# Altium schematic sheet 测试板3.SchDoc
size A3
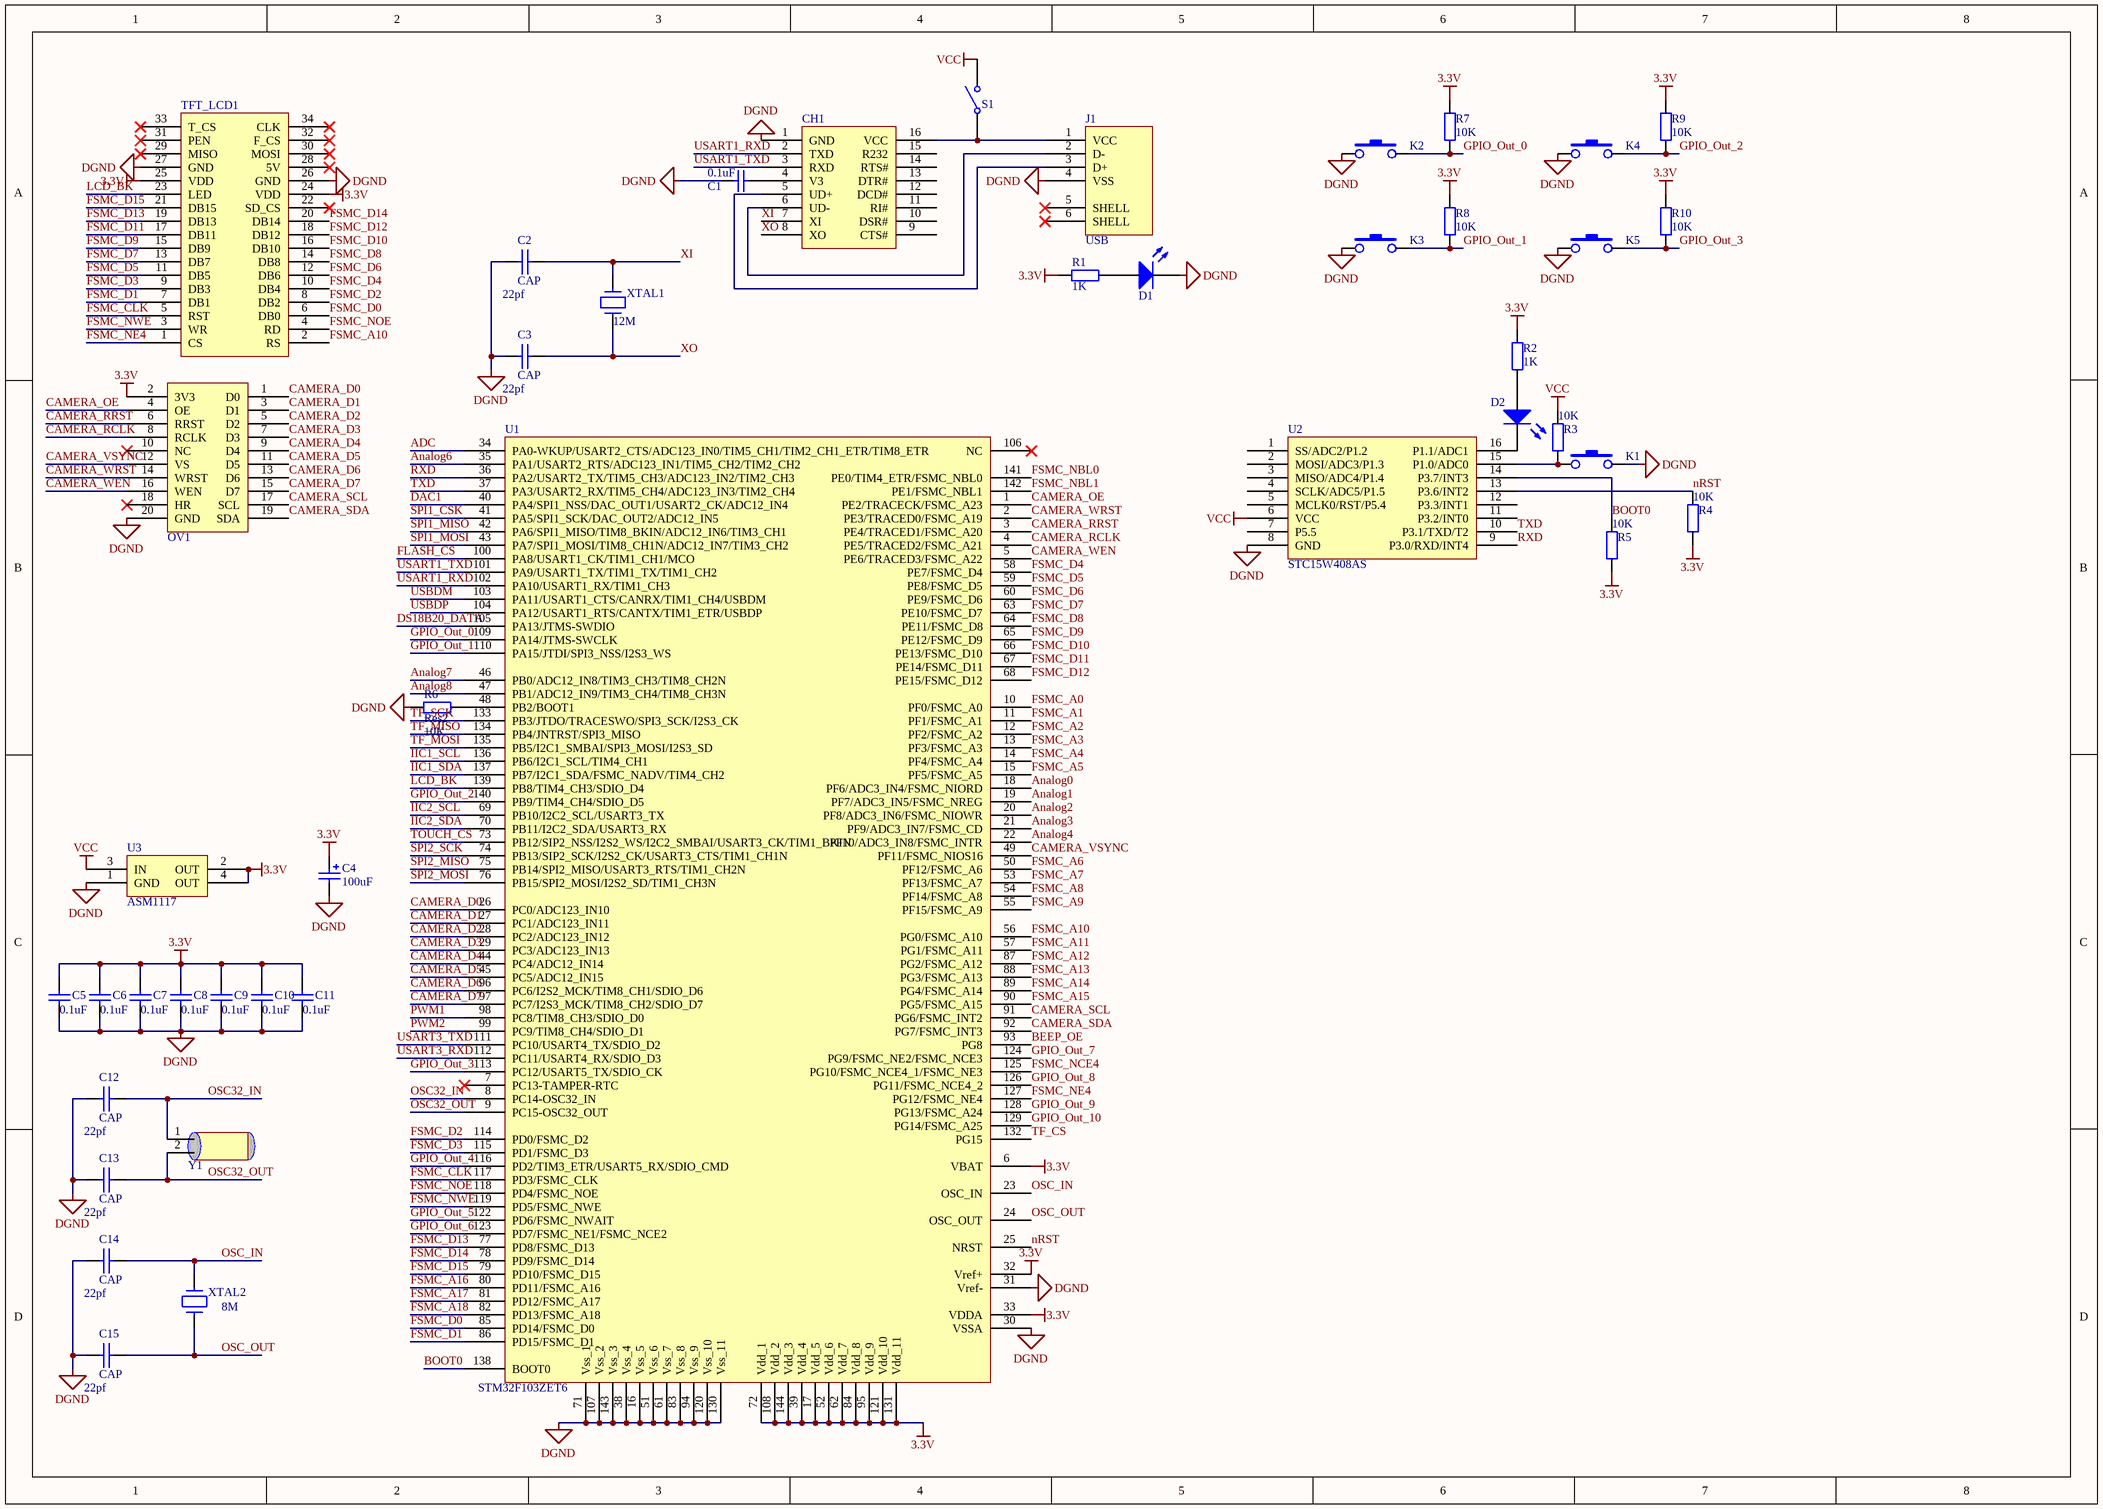
[diagram p0: 测试板3.SchDoc]

## Parts
C1  value 0.1uF  [0805]  (hidden comment: Cap)
C2  CAP  value 22pf  [0805]
C3  CAP  value 22pf  [0805]
C4  value 100uF  [RB.1/.3]  (hidden comment: Cap Pol2)
C5  value 0.1uF  [0805]  (hidden comment: Cap)
C6  value 0.1uF  [0805]  (hidden comment: Cap)
C7  value 0.1uF  [0805]  (hidden comment: Cap)
C8  value 0.1uF  [0805]  (hidden comment: Cap)
C9  value 0.1uF  [0805]  (hidden comment: Cap)
C10  value 0.1uF  [0805]  (hidden comment: Cap)
C11  value 0.1uF  [0805]  (hidden comment: Cap)
C12  CAP  value 22pf  [0805]
C13  CAP  value 22pf  [0805]
C14  CAP  value 22pf  [0805]
C15  CAP  value 22pf  [0805]
CH1  Component_1  [SOIC127P600X170-16N]  (value not drawn)
D1  LED0  [LED-0805]  (value not drawn)
D2  LED0  [LED-0805]  (value not drawn)
J1  USB  [USB_B1]
K1  button  [SW_PB4_A1]  (value not drawn)
K2  button  [SW_PB4_A1]  (value not drawn)
K3  button  [SW_PB4_A1]  (value not drawn)
K4  button  [SW_PB4_A1]  (value not drawn)
K5  button  [SW_PB4_A1]  (value not drawn)
OV1  OV7725摄像头  [HDR2X10]  (value not drawn)
R1  value 1K  [0805]  (hidden comment: Res2)
R2  value 1K  [0805]  (hidden comment: Res2)
R3  value 10K  [0805]  (hidden comment: Res2)
R4  value 10K  [0805]  (hidden comment: Res2)
R5  value 10K  [0805]  (hidden comment: Res2)
R6  Res2  value 10K  [0805]
R7  value 10K  [0805]  (hidden comment: Res2)
R8  value 10K  [0805]  (hidden comment: Res2)
R9  value 10K  [0805]  (hidden comment: Res2)
R10  value 10K  [0805]  (hidden comment: Res2)
S1  SW-SPST  [SWITCH_B1]  (value not drawn)
TFT_LCD1  Component_1  [HDR2X17]  (value not drawn)
U1  STM32F103ZET6  [TQFP-144]
U2  STC15W408AS  [SOIC127P600X170-16N]
U3  ASM1117  [SOT223]
XTAL1  value 12M  [X-SM49]  (hidden comment: CRYSTAL)
XTAL2  value 8M  [X-SM49]  (hidden comment: CRYSTAL)
Y1  32K晶振  [X-TC15]  (value not drawn)

## Nets
3.3V: C4.1 C5.2 C6.2 C7.2 C8.2 C9.2 C10.2 C11.2 OV1.2(3V3) R1.1 R2.1 R4.1 R5.1 R7.1 R8.1 R9.1 R10.1 TFT_LCD1.24(VDD) TFT_LCD1.25(VDD) U1.6(VBAT) U1.17(Vdd_5) U1.32(Vref+) U1.33(VDDA) U1.39(Vdd_4) U1.52(Vdd_6) U1.62(Vdd_7) U1.72(Vdd_1) U1.84(Vdd_8) U1.95(Vdd_9) U1.108(Vdd_2) U1.121(Vdd_10) U1.131(Vdd_11) U1.144(Vdd_3) U3.2(OUT) U3.4(OUT)
DGND: C1.2 C2.1 C3.1 C4.2 C5.1 C6.1 C7.1 C8.1 C9.1 C10.1 C11.1 C12.1 C13.1 C14.1 C15.1 CH1.1(GND) D1.2(K) J1.4(VSS) K1.2 K2.1 K3.1 K4.1 K5.1 OV1.20(GND) R6.1 TFT_LCD1.26(GND) TFT_LCD1.27(GND) U1.16(Vss_5) U1.30(VSSA) U1.31(Vref-) U1.38(Vss_4) U1.51(Vss_6) U1.61(Vss_7) U1.71(Vss_1) U1.83(Vss_8) U1.94(Vss_9) U1.107(Vss_2) U1.120(Vss_10) U1.130(Vss_11) U1.143(Vss_3) U2.8(GND) U3.1(GND)
VCC: R3.2 S1.2(NO) U2.6(VCC) U3.3(IN)
ADC: U1.34(PA0-WKUP/USART2_CTS/ADC123_IN0/TIM5_CH1/TIM2_CH1_ETR/TIM8_ETR)
Analog0: U1.18(PF6/ADC3_IN4/FSMC_NIORD)
Analog1: U1.19(PF7/ADC3_IN5/FSMC_NREG)
Analog2: U1.20(PF8/ADC3_IN6/FSMC_NIOWR)
Analog3: U1.21(PF9/ADC3_IN7/FSMC_CD)
Analog4: U1.22(PF10/ADC3_IN8/FSMC_INTR)
Analog6: U1.35(PA1/USART2_RTS/ADC123_IN1/TIM5_CH2/TIM2_CH2)
Analog7: U1.46(PB0/ADC12_IN8/TIM3_CH3/TIM8_CH2N)
Analog8: U1.47(PB1/ADC12_IN9/TIM3_CH4/TIM8_CH3N)
BEEP_OE: U1.93(PG8)
BOOT0: R5.2 U1.138(BOOT0) U2.14(P3.7/INT3)
CAMERA_D0: OV1.1(D0) U1.26(PC0/ADC123_IN10)
CAMERA_D1: OV1.3(D1) U1.27(PC1/ADC123_IN11)
CAMERA_D2: OV1.5(D2) U1.28(PC2/ADC123_IN12)
CAMERA_D3: OV1.7(D3) U1.29(PC3/ADC123_IN13)
CAMERA_D4: OV1.9(D4) U1.44(PC4/ADC12_IN14)
CAMERA_D5: OV1.11(D5) U1.45(PC5/ADC12_IN15)
CAMERA_D6: OV1.13(D6) U1.96(PC6/I2S2_MCK/TIM8_CH1/SDIO_D6)
CAMERA_D7: OV1.15(D7) U1.97(PC7/I2S3_MCK/TIM8_CH2/SDIO_D7)
CAMERA_OE: OV1.4(OE) U1.1(PE2/TRACECK/FSMC_A23)
CAMERA_RCLK: OV1.8(RCLK) U1.4(PE5/TRACED2/FSMC_A21)
CAMERA_RRST: OV1.6(RRST) U1.3(PE4/TRACED1/FSMC_A20)
CAMERA_SCL: OV1.17(SCL) U1.91(PG6/FSMC_INT2)
CAMERA_SDA: OV1.19(SDA) U1.92(PG7/FSMC_INT3)
CAMERA_VSYNC: OV1.12(VS) U1.49(PF11/FSMC_NIOS16)
CAMERA_WEN: OV1.16(WEN) U1.5(PE6/TRACED3/FSMC_A22)
CAMERA_WRST: OV1.14(WRST) U1.2(PE3/TRACED0/FSMC_A19)
DAC1: U1.40(PA4/SPI1_NSS/DAC_OUT1/USART2_CK/ADC12_IN4)
DS18B20_DATA: U1.105(PA13/JTMS-SWDIO)
FLASH_CS: U1.100(PA8/USART1_CK/TIM1_CH1/MCO)
FSMC_A0: U1.10(PF0/FSMC_A0)
FSMC_A1: U1.11(PF1/FSMC_A1)
FSMC_A2: U1.12(PF2/FSMC_A2)
FSMC_A3: U1.13(PF3/FSMC_A3)
FSMC_A4: U1.14(PF4/FSMC_A4)
FSMC_A5: U1.15(PF5/FSMC_A5)
FSMC_A6: U1.50(PF12/FSMC_A6)
FSMC_A7: U1.53(PF13/FSMC_A7)
FSMC_A8: U1.54(PF14/FSMC_A8)
FSMC_A9: U1.55(PF15/FSMC_A9)
FSMC_A10: TFT_LCD1.2(RS) U1.56(PG0/FSMC_A10)
FSMC_A11: U1.57(PG1/FSMC_A11)
FSMC_A12: U1.87(PG2/FSMC_A12)
FSMC_A13: U1.88(PG3/FSMC_A13)
FSMC_A14: U1.89(PG4/FSMC_A14)
FSMC_A15: U1.90(PG5/FSMC_A15)
FSMC_A16: U1.80(PD11/FSMC_A16)
FSMC_A17: U1.81(PD12/FSMC_A17)
FSMC_A18: U1.82(PD13/FSMC_A18)
FSMC_CLK: TFT_LCD1.5(RST) U1.117(PD3/FSMC_CLK)
FSMC_D0: TFT_LCD1.6(DB0) U1.85(PD14/FSMC_D0)
FSMC_D1: TFT_LCD1.7(DB1) U1.86(PD15/FSMC_D1)
FSMC_D2: TFT_LCD1.8(DB2) U1.114(PD0/FSMC_D2)
FSMC_D3: TFT_LCD1.9(DB3) U1.115(PD1/FSMC_D3)
FSMC_D4: TFT_LCD1.10(DB4) U1.58(PE7/FSMC_D4)
FSMC_D5: TFT_LCD1.11(DB5) U1.59(PE8/FSMC_D5)
FSMC_D6: TFT_LCD1.12(DB6) U1.60(PE9/FSMC_D6)
FSMC_D7: TFT_LCD1.13(DB7) U1.63(PE10/FSMC_D7)
FSMC_D8: TFT_LCD1.14(DB8) U1.64(PE11/FSMC_D8)
FSMC_D9: TFT_LCD1.15(DB9) U1.65(PE12/FSMC_D9)
FSMC_D10: TFT_LCD1.16(DB10) U1.66(PE13/FSMC_D10)
FSMC_D11: TFT_LCD1.17(DB11) U1.67(PE14/FSMC_D11)
FSMC_D12: TFT_LCD1.18(DB12) U1.68(PE15/FSMC_D12)
FSMC_D13: TFT_LCD1.19(DB13) U1.77(PD8/FSMC_D13)
FSMC_D14: TFT_LCD1.20(DB14) U1.78(PD9/FSMC_D14)
FSMC_D15: TFT_LCD1.21(DB15) U1.79(PD10/FSMC_D15)
FSMC_NBL0: U1.141(PE0/TIM4_ETR/FSMC_NBL0)
FSMC_NBL1: U1.142(PE1/FSMC_NBL1)
FSMC_NCE4: U1.125(PG10/FSMC_NCE4_1/FSMC_NE3)
FSMC_NE4: TFT_LCD1.1(CS) U1.127(PG12/FSMC_NE4)
FSMC_NOE: TFT_LCD1.4(RD) U1.118(PD4/FSMC_NOE)
FSMC_NWE: TFT_LCD1.3(WR) U1.119(PD5/FSMC_NWE)
GPIO_Out_0: K2.2 R7.2 U1.109(PA14/JTMS-SWCLK)
GPIO_Out_1: K3.2 R8.2 U1.110(PA15/JTDI/SPI3_NSS/I2S3_WS)
GPIO_Out_2: K4.2 R9.2 U1.140(PB9/TIM4_CH4/SDIO_D5)
GPIO_Out_3: K5.2 R10.2 U1.113(PC12/USART5_TX/SDIO_CK)
GPIO_Out_4: U1.116(PD2/TIM3_ETR/USART5_RX/SDIO_CMD)
GPIO_Out_5: U1.122(PD6/FSMC_NWAIT)
GPIO_Out_6: U1.123(PD7/FSMC_NE1/FSMC_NCE2)
GPIO_Out_7: U1.124(PG9/FSMC_NE2/FSMC_NCE3)
GPIO_Out_8: U1.126(PG11/FSMC_NCE4_2)
GPIO_Out_9: U1.128(PG13/FSMC_A24)
GPIO_Out_10: U1.129(PG14/FSMC_A25)
IIC1_SCL: U1.136(PB6/I2C1_SCL/TIM4_CH1)
IIC1_SDA: U1.137(PB7/I2C1_SDA/FSMC_NADV/TIM4_CH2)
IIC2_SCL: U1.69(PB10/I2C2_SCL/USART3_TX)
IIC2_SDA: U1.70(PB11/I2C2_SDA/USART3_RX)
LCD_BK: TFT_LCD1.23(LED) U1.139(PB8/TIM4_CH3/SDIO_D4)
nRST: R4.2 U1.25(NRST) U2.13(P3.6/INT2)
OSC32_IN: C12.2 U1.8(PC14-OSC32_IN) Y1.1(X1)
OSC32_OUT: C13.2 U1.9(PC15-OSC32_OUT) Y1.2(X2)
OSC_IN: C14.2 U1.23(OSC_IN) XTAL2.2
OSC_OUT: C15.2 U1.24(OSC_OUT) XTAL2.1
PWM1: U1.98(PC8/TIM8_CH3/SDIO_D0)
PWM2: U1.99(PC9/TIM8_CH4/SDIO_D1)
RXD: U1.36(PA2/USART2_TX/TIM5_CH3/ADC123_IN2/TIM2_CH3) U2.9(P3.0/RXD/INT4)
SPI1_CSK: U1.41(PA5/SPI1_SCK/DAC_OUT2/ADC12_IN5)
SPI1_MISO: U1.42(PA6/SPI1_MISO/TIM8_BKIN/ADC12_IN6/TIM3_CH1)
SPI1_MOSI: U1.43(PA7/SPI1_MOSI/TIM8_CH1N/ADC12_IN7/TIM3_CH2)
SPI2_MISO: U1.75(PB14/SPI2_MISO/USART3_RTS/TIM1_CH2N)
SPI2_MOSI: U1.76(PB15/SPI2_MOSI/I2S2_SD/TIM1_CH3N)
SPI2_SCK: U1.74(PB13/SIP2_SCK/I2S2_CK/USART3_CTS/TIM1_CH1N)
TF_CS: U1.132(PG15)
TF_MISO: U1.134(PB4/JNTRST/SPI3_MISO)
TF_MOSI: U1.135(PB5/I2C1_SMBAI/SPI3_MOSI/I2S3_SD)
TF_SCK: U1.133(PB3/JTDO/TRACESWO/SPI3_SCK/I2S3_CK)
TOUCH_CS: U1.73(PB12/SIP2_NSS/I2S2_WS/I2C2_SMBAI/USART3_CK/TIM1_BKIN)
TXD: U1.37(PA3/USART2_RX/TIM5_CH4/ADC123_IN3/TIM2_CH4) U2.10(P3.1/TXD/T2)
USART1_RXD: CH1.2(TXD) U1.102(PA10/USART1_RX/TIM1_CH3)
USART1_TXD: CH1.3(RXD) U1.101(PA9/USART1_TX/TIM1_TX/TIM1_CH2)
USART3_RXD: U1.112(PC11/USART4_RX/SDIO_D3)
USART3_TXD: U1.111(PC10/USART4_TX/SDIO_D2)
USBDM: U1.103(PA11/USART1_CTS/CANRX/TIM1_CH4/USBDM)
USBDP: U1.104(PA12/USART1_RTS/CANTX/TIM1_ETR/USBDP)
XI: C2.2 CH1.7(XI) XTAL1.2
XO: C3.2 CH1.8(XO) XTAL1.1
NetC1_1: C1.1 CH1.4(V3)
NetCH1_5: CH1.5(UD+) J1.3(D+)
NetCH1_6: CH1.6(UD-) J1.2(D-)
NetCH1_16: CH1.16(VCC) J1.1(VCC) S1.1(COMMON)
NetD1_1: D1.1(A) R1.2
NetD2_1: D2.1(A) R2.2
NetD2_2: D2.2(K) U2.16(P1.1/ADC1)
NetK1_1: K1.1 R3.1 U2.15(P1.0/ADC0)
NetR6_2: R6.2 U1.48(PB2/BOOT1)

Not connected (* = marked no-connect by the designer): CH1 9(CTS#) 10(DSR#) 11(RI#) 12(DCD#) 13(DTR#) 14(RTS#) 15(R232); J1 5(SHELL)* 6(SHELL)*; OV1 10(NC)* 18(HR)*; TFT_LCD1 22(SD_CS)* 28(5V)* 29(MISO)* 30(MOSI)* 31(PEN)* 32(F_CS)* 33(T_CS)* 34(CLK)*; U1 7(PC13-TAMPER-RTC)* 106(NC)*; U2 1(SS/ADC2/P1.2) 2(MOSI/ADC3/P1.3) 3(MISO/ADC4/P1.4) 4(SCLK/ADC5/P1.5) 5(MCLK0/RST/P5.4) 7(P5.5) 11(P3.2/INT0) 12(P3.3/INT1)

## Library data of the parts
C1 C5-C11 = Cap: Capacitor; Published: 8-Jun-2000; LatestRevisionDate: 17-Jul-2002; LatestRevisionNote: Re-released for DXP Platform.; PackageReference: RAD-0.3; Publisher: Altium Limited; PackageDescription: Radial Cap, Thru-Hole; 2 Leads; 0.3 in Pin Spacing
C4 = Cap Pol2: Polarized Capacitor (Axial); Published: 8-Jun-2000; LatestRevisionDate: 17-Jul-2002; LatestRevisionNote: Re-released for DXP Platform.; PackageReference: POLAR0.8; Publisher: Altium Limited; PackageDescription: Polarized Capacitor; 2 Leads
D1 D2 = LED0: 发光二极管; Published: 8-Jun-2000; LatestRevisionDate: 08-Jul-2005; LatestRevisionNote: Mech Layer 1 removed.; PackageReference: LED-0; Publisher: Altium Limited
J1 = USB: USB接口
R1-R10 = Res2: Resistor; Published: 8-Jun-2000; LatestRevisionDate: 17-Jul-2002; LatestRevisionNote: Re-released for DXP Platform.; PackageReference: AXIAL-0.4; Publisher: Altium Limited; PackageDescription: Axial Device, Thru-Hole; 2 Leads; 0.4 in Pin Spacing
S1 = SW-SPST: Single-Pole, Single-Throw Switch; Published: 24-Mar-1999; LatestRevisionDate: 17-Jul-2002; LatestRevisionNote: Re-released for DXP Platform.; PackageReference: SPST-2; Publisher: Altium Limited; PackageDescription: Switch; 2 Leads
U3 = ASM1117: 3.3V稳压芯片